# EAGLE design napajalnik (EAGLE 6.5.0)
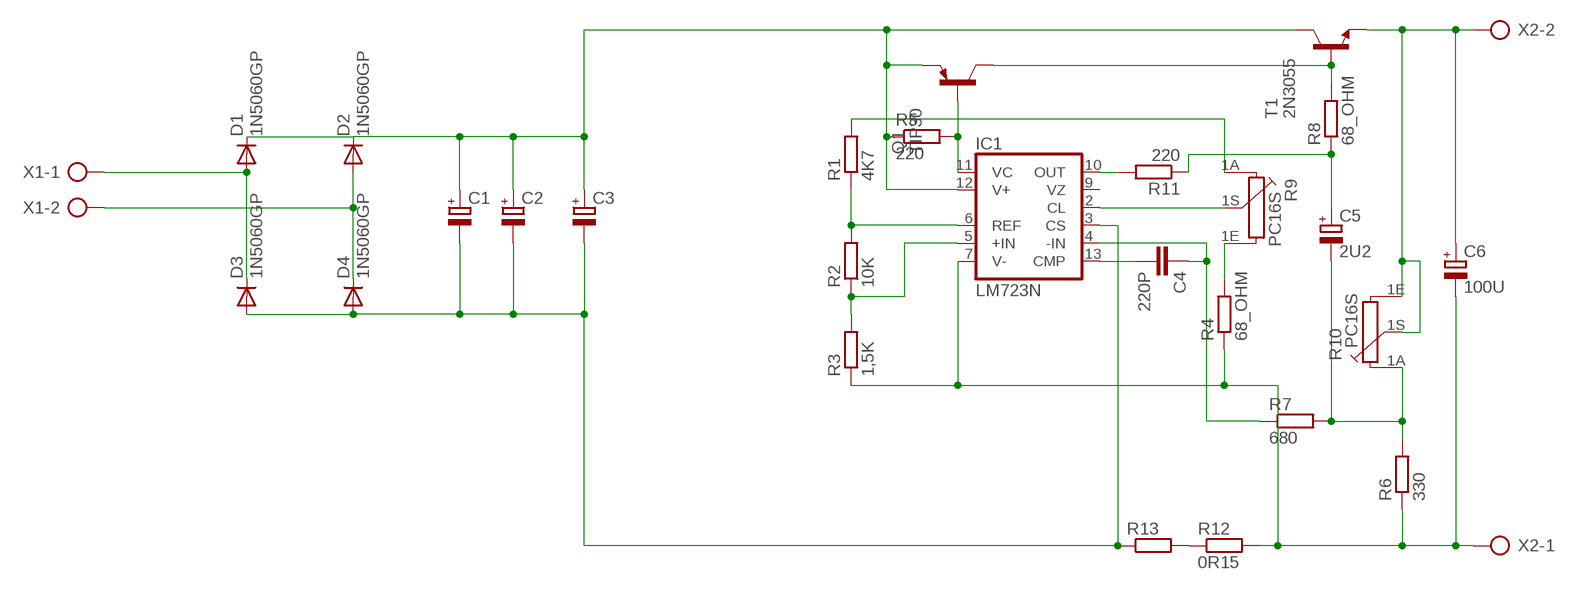
[diagram p0: schematic, sheet 1]

## Parts
C1  CPOL-EUE10-20  [EB20D]
C2  CPOL-EUE10-20  [EB20D]
C3  CPOL-EUE10-20  [EB20D]
C4  220P  C-EU050-035X075  [C050-035X075]
C5  2U2  CPOL-EUTAP5-45  [TAP5-45]
C6  100U  CPOL-EUTAP5-80  [TAP5-80]
D1  1N5060GP  [DO15-12]
D2  1N5060GP  [DO15-12]
D3  1N5060GP  [DO15-12]
D4  1N5060GP  [DO15-12]
IC1  LM723N  [DIL14]
Q1  TIP30  [TO220]
R1  4K7  R-EU_0411/15  [0411/15]
R2  10K  R-EU_0411/15  [0411/15]
R3  1,5K  R-EU_0411/15  [0411/15]
R4  68_OHM  R-EU_0411/15  [0411/15]
R5  220  R-EU_0411/15  [0411/15]
R6  330  R-EU_0411/15  [0411/15]
R7  680  R-EU_0411/15  [0411/15]
R8  68_OHM  R-EU_0411/15  [0411/15]
R9  PC16S  [PC16S]
R10  PC16S  [PC16S]
R11  220  R-EU_0411/15  [0411/15]
R12  0R15  R-EU_0411/15  [0411/15]
R13  R-EU_0411/15  [0411/15]
T1  2N3055  [TO3]
X1  AK300/2  [AK300/2]
X2  AK300/2  [AK300/2]

## Nets
+: C6.+ R10.1E R10.1S T1.E X2.2
GND1: C6.- IC1.7(V-) R3.1 R4.1 R6.1 R12.2 X2.1
N$2: C1.+ C2.+ C3.+ D1.C D2.C IC1.12(V+) Q1.3(E) R5.1 T1.C T1.C/(C)
N$3: D1.A D3.C X1.1
N$4: D2.A D4.C X1.2
N$5: C1.- C2.- C3.- D3.A D4.A IC1.3(CS) R13.1
N$6: IC1.6(REF) R1.1 R2.2
N$7: IC1.5(+IN) R2.1 R3.2
N$8: C5.- R6.2 R7.2 R10.1A
N$9: R1.2 R9.1A
N$10: R4.2 R9.1E
N$11: IC1.11(VC) Q1.1(B) R5.2
N$12: Q1.2(C) R8.2 T1.B
N$14: C4.1 IC1.4(-IN) R7.1
N$15: IC1.2(CL) R9.1S
N$16: C4.2 IC1.13(CMP)
N$18: IC1.10(OUT) R11.2
N$19: C5.+ R8.1 R11.1
N$20: R12.1 R13.2
Unconnected: IC1.9(VZ)

## Library data of the parts
C1-C3 C5 C6 = rcl:CPOL-EU: POLARIZED CAPACITOR, European symbol
C4 = rcl:C-EU: CAPACITOR, European symbol
D1-D4 = diode:1N5060GP: DIODE controlled avalanche rectifier
IC1 = linear:*723: Positive VOLTAGE REGULATOR
Q1 = transistor-pnp:TIP30: PNP Transistor
R1-R8 R11-R13 = rcl:R-EU_: RESISTOR, European symbol
R9 R10 = piher:PC16S: POTENTIOMETER single carbon potentiometer, 16 mm, S3ROH; OC_FARNELL: 4452940; OC_NEWARK: unknown
T1 = transistor:2N3055: NPN TRANSISTOR
X1 X2 = con-ptr500:AK300/2: CONNECTOR; OC_FARNELL: unknown; OC_NEWARK: unknown

## Board
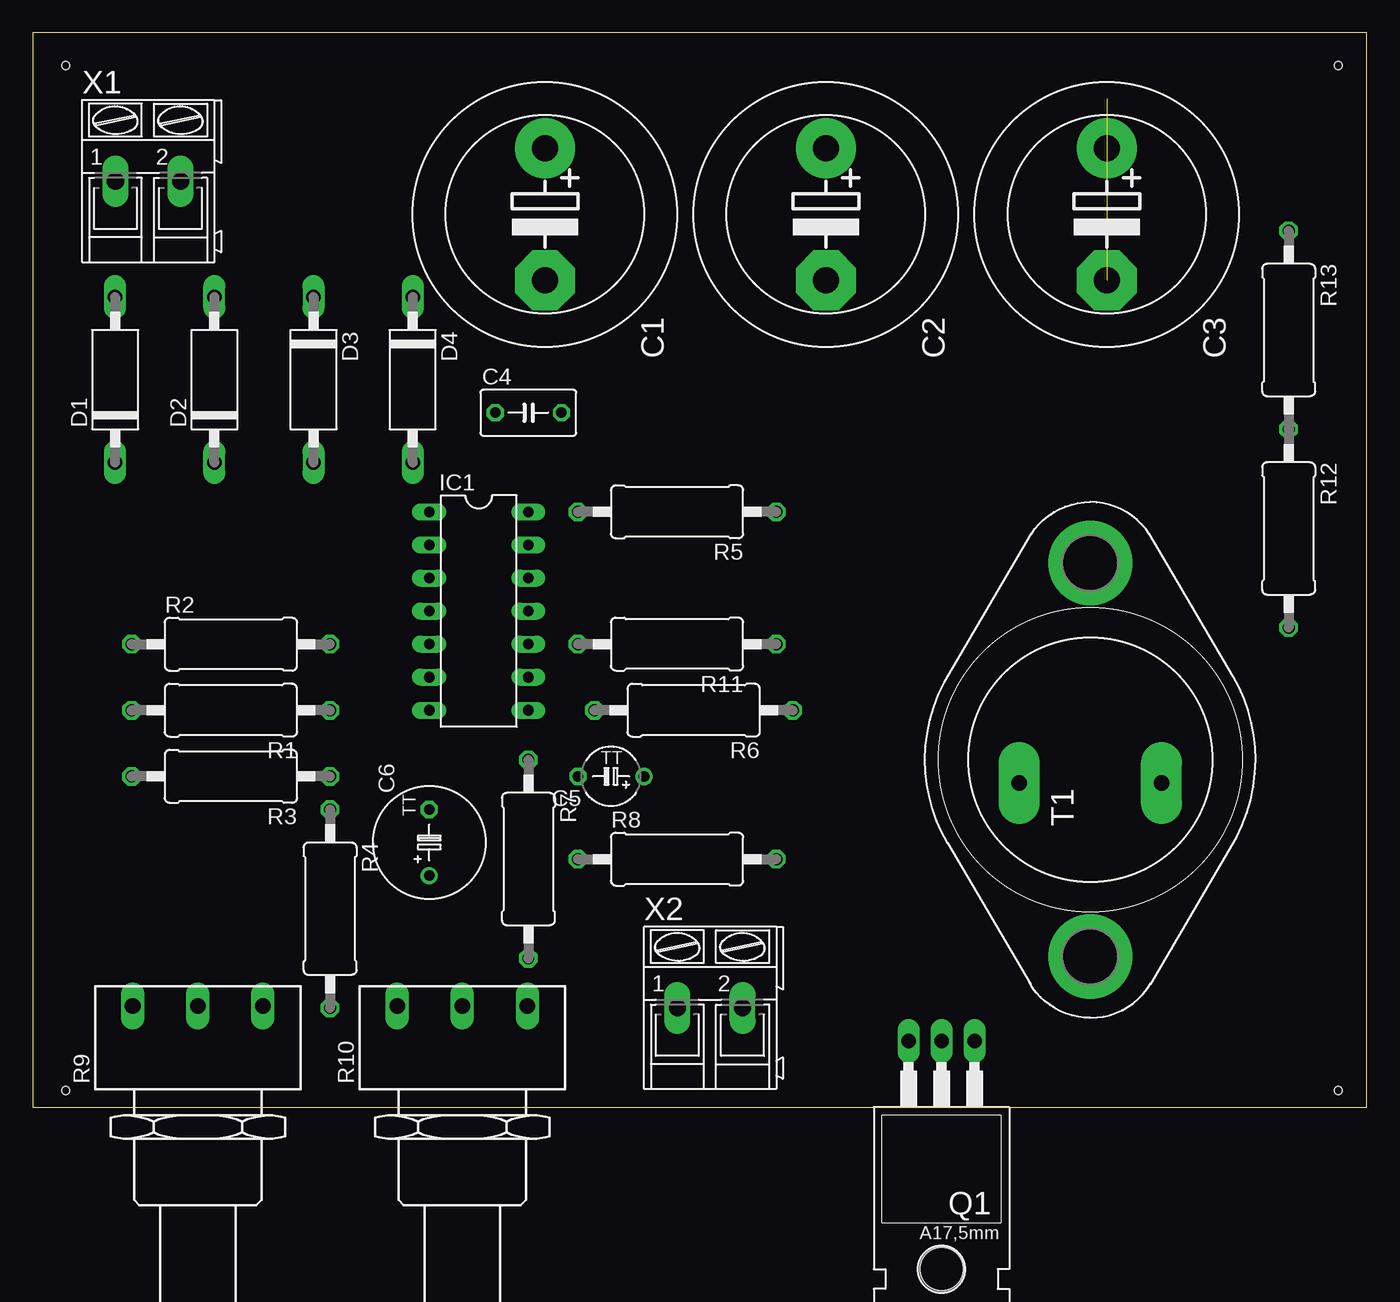
[diagram p1: board, top side]
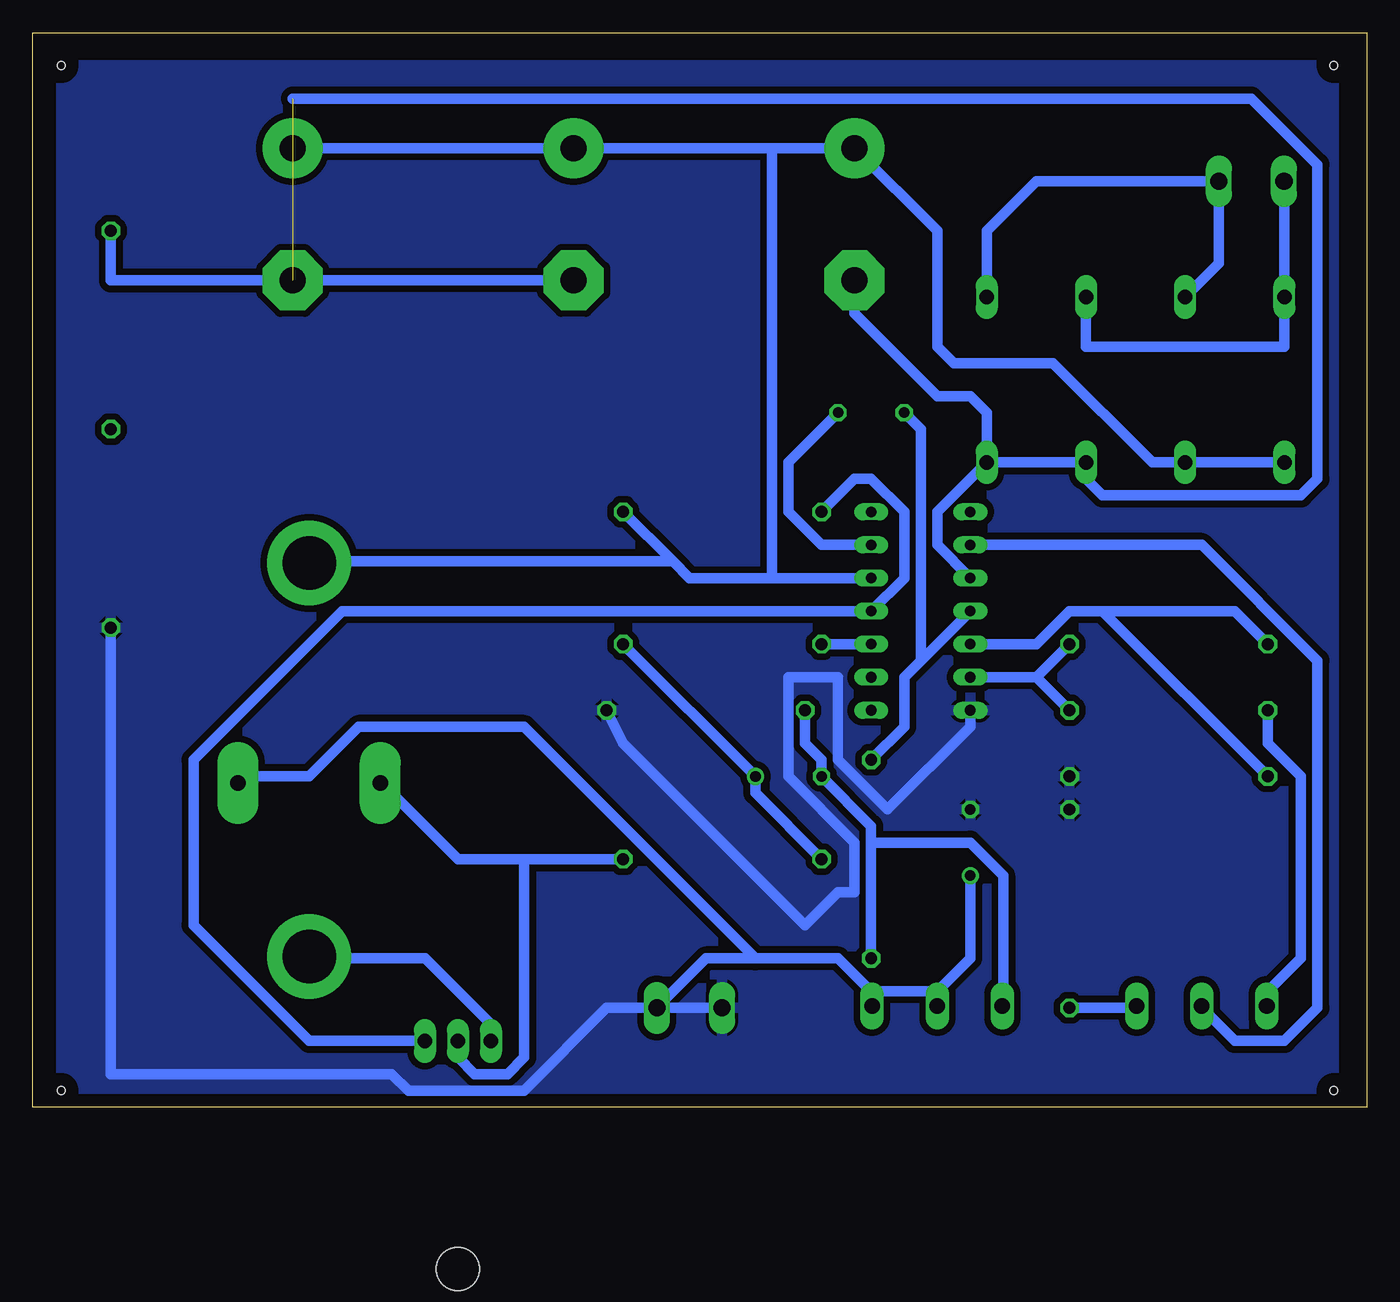
[diagram p2: board, bottom side, seen from below]

Size 102.54 x 82.54 mm. Coordinates in mm from the lower left corner, seen from the top.
Outline: 0,0 102.54,0 102.54,82.54 0,82.54 0,0
Copper layers (1*16): Top 0.035mm / dielectric 1.5mm / Bottom 0.035mm
Design rules "default *": minimum track width 32mil, minimum drill 24mil, track to track 20mil, track to pad 20mil, pad to pad 8mil, via to via 8mil, smd to smd 8mil, copper to edge 40mil, drill to drill 8mil, minimum pad ring 10mil, minimum via ring 8mil, stop-mask expansion 4mil, vias tented up to drill 0mil, thermal gap 10mil
Holes 0.6 mm at 2.54,80.01 2.54,1.27 100.33,1.27 100.33,80.01

### Footprints (pad centres in the part's own frame; a part is rotated, then mirrored left to right if it is on the bottom)
EB20D = drill 2.007 pad 4.597: + -5.08,0 | drill 2.007 pad 4.597 octagon: - 5.08,0
C050-035X075 = drill 0.813 octagon: 1 -2.54,0; 2 2.54,0
TAP5-45 = drill 0.813: + -2.54,0 | drill 0.813 octagon: - 2.54,0
TAP5-80 = drill 0.813: + -2.54,0 | drill 0.813 octagon: - 2.54,0
DO15-12 = drill 1.118 long: A 6.35,0; C -6.35,0
DIL14 = drill 0.813 long: 1 -7.62,-3.81; 2 -5.08,-3.81; 3 -2.54,-3.81; 4 0,-3.81; 5 2.54,-3.81; 6 5.08,-3.81; 7 7.62,-3.81; 8 7.62,3.81; 9 5.08,3.81; 10 2.54,3.81; 11 0,3.81; 12 -2.54,3.81; 13 -5.08,3.81; 14 -7.62,3.81
TO220 = drill 1.118 long: 1 -2.54,-6.35; 2 0,-6.35; 3 2.54,-6.35 | hole 3.302: 0,11.176
0411/15 = drill 0.914 octagon: 1 -7.62,0; 2 7.62,0
PC16S = drill 1.2 long: 1A -5,6.5; 1E 5,6.5; 1S 0,6.5
TO3 = drill 1.194 pad 3.15 long: B -1.778,5.461; E -1.778,-5.461 | drill 4.115 pad 6.477: C 15.113,0; C/ -15.113,0
AK300/2 = drill 1.321 long: 1 -2.515,0; 2 2.489,0

### Placement (x,y rotation side)
C1  39.37,68.58 270 top
C2  60.96,68.58 270 top
C3  82.55,68.58 270 top
C4  38.1,53.34 0 top
C5  44.45,25.4 180 top
C6  30.48,20.32 90 top
D1  6.35,55.88 90 top
D2  13.97,55.88 90 top
D3  21.59,55.88 270 top
D4  29.21,55.88 270 top
IC1  34.29,38.1 270 top
Q1  69.85,-1.27 180 top
R1  15.24,30.48 180 top
R2  15.24,35.56 0 top
R3  15.24,25.4 180 top
R4  22.86,15.24 270 top
R5  49.53,45.72 180 top
R6  50.8,30.48 180 top
R7  38.1,19.05 270 top
R8  49.53,19.05 0 top
R9  12.7,1.27 0 top
R10  33.02,1.27 0 top
R11  49.53,35.56 180 top
R12  96.52,44.45 270 top
R13  96.52,59.69 270 top
T1  81.28,26.67 90 top
X1  8.89,71.12 0 top
X2  52.07,7.62 0 top

### Tracks (layer width: path | path; a pad name or v marks a point on that pad's centre or on a via)
+
  Bottom 0.813: C6.+ 30.48,11.43 33.02,8.89 | 33.02,8.89 38.1,8.89 | 33.02,8.89 R10.1S | 46.99,11.43 40.64,11.43 38.1,8.89 | 46.99,11.43 50.8,11.43 54.61,7.62 X2.2 | 38.1,8.89 R10.1E | 46.99,11.43 64.77,29.21 77.47,29.21 81.28,25.4 86.36,25.4 T1.E
GND1
  Bottom 0.813: X2.1 58.42,7.62 64.77,1.27 73.66,1.27 74.93,2.54 96.52,2.54 R12.2 | R6.1 57.15,27.94 43.18,13.97 40.64,16.51 39.37,16.51 39.37,20.32 44.45,25.4 44.45,33.02 40.64,33.02 40.64,26.67 36.83,22.86 30.48,29.21 IC1.7
  pour Bottom: 2.54,1.27 100.33,1.27 100.33,80.01 2.54,80.01
N$2
  Bottom 0.813: Q1.3 67.31,6.35 72.39,11.43 81.28,11.43 T1.C/ | 45.72,40.64 52.07,40.64 53.34,41.91 | 45.72,40.64 IC1.12 | R5.1 53.34,41.91 | D1.C D2.C 16.51,49.53 24.13,57.15 31.75,57.15 33.02,58.42 33.02,67.31 C1.+ 45.72,73.66 | 45.72,73.66 C2.+ C3.+ | 45.72,73.66 45.72,40.64 | 53.34,41.91 81.28,41.91 T1.C
N$3
  Bottom 0.813: X1.1 6.35,71.12 D1.A 6.35,58.42 21.59,58.42 D3.C
N$4
  Bottom 0.813: D2.A 11.38,64.82 X1.2 25.4,71.12 29.21,67.31 D4.C
N$5  (1 unrouted)
  Bottom 0.813: C2.- C3.- 96.52,63.5 R13.1 | IC1.3 33.02,43.18 33.02,45.72 D4.A | 82.55,77.47 8.89,77.47 3.81,72.39 3.81,48.26 5.08,46.99 20.32,46.99 21.59,48.26 D3.A D4.A | D4.A 29.21,53.34 30.48,54.61 33.02,54.61 39.37,60.96 C1.-
N$6
  Bottom 0.813: 25.4,33.02 IC1.6 | R2.2 25.4,33.02 | 25.4,33.02 R1.1
N$7
  Bottom 0.813: IC1.5 25.4,35.56 22.86,38.1 20.32,38.1 | 20.32,38.1 10.16,38.1 R2.1 | 20.32,38.1 R3.2
N$8
  Bottom 0.813: 38.1,20.32 38.1,21.59 C5.- 41.91,26.67 43.18,27.94 R6.2 | 38.1,20.32 R7.2 | 38.1,20.32 30.48,20.32 27.94,17.78 27.94,8.89 R10.1A
N$9
  Bottom 0.813: R1.2 7.62,27.94 5.08,25.4 5.08,11.43 7.62,8.89 R9.1A
N$10
  Bottom 0.813: R4.2 17.78,7.62 R9.1E
N$11
  Bottom 0.813: R5.2 39.37,48.26 38.1,48.26 35.56,45.72 35.56,40.64 IC1.11 78.74,38.1 90.17,26.67 90.17,13.97 81.28,5.08 Q1.1
N$12
  Bottom 0.813: 64.77,19.05 69.85,19.05 74.93,24.13 T1.B | 64.77,19.05 R8.2 | Q1.2 69.85,3.81 68.58,2.54 66.04,2.54 64.77,3.81 64.77,19.05
N$14
  Bottom 0.813: 34.29,34.29 35.56,33.02 35.56,29.21 R7.1 | 34.29,34.29 IC1.4 | 34.29,34.29 34.29,52.07 C4.1
N$15
  Bottom 0.813: IC1.2 12.7,43.18 3.81,34.29 3.81,7.62 6.35,5.08 10.16,5.08 12.7,7.62 R9.1S
N$16
  Bottom 0.813: IC1.13 41.91,43.18 44.45,45.72 44.45,49.53 C4.2
N$18
  Bottom 0.813: R11.2 IC1.10
N$19
  Bottom 0.813: R11.1 C5.+ 46.99,24.13 R8.1